# Altium project voltage.PrjPcb
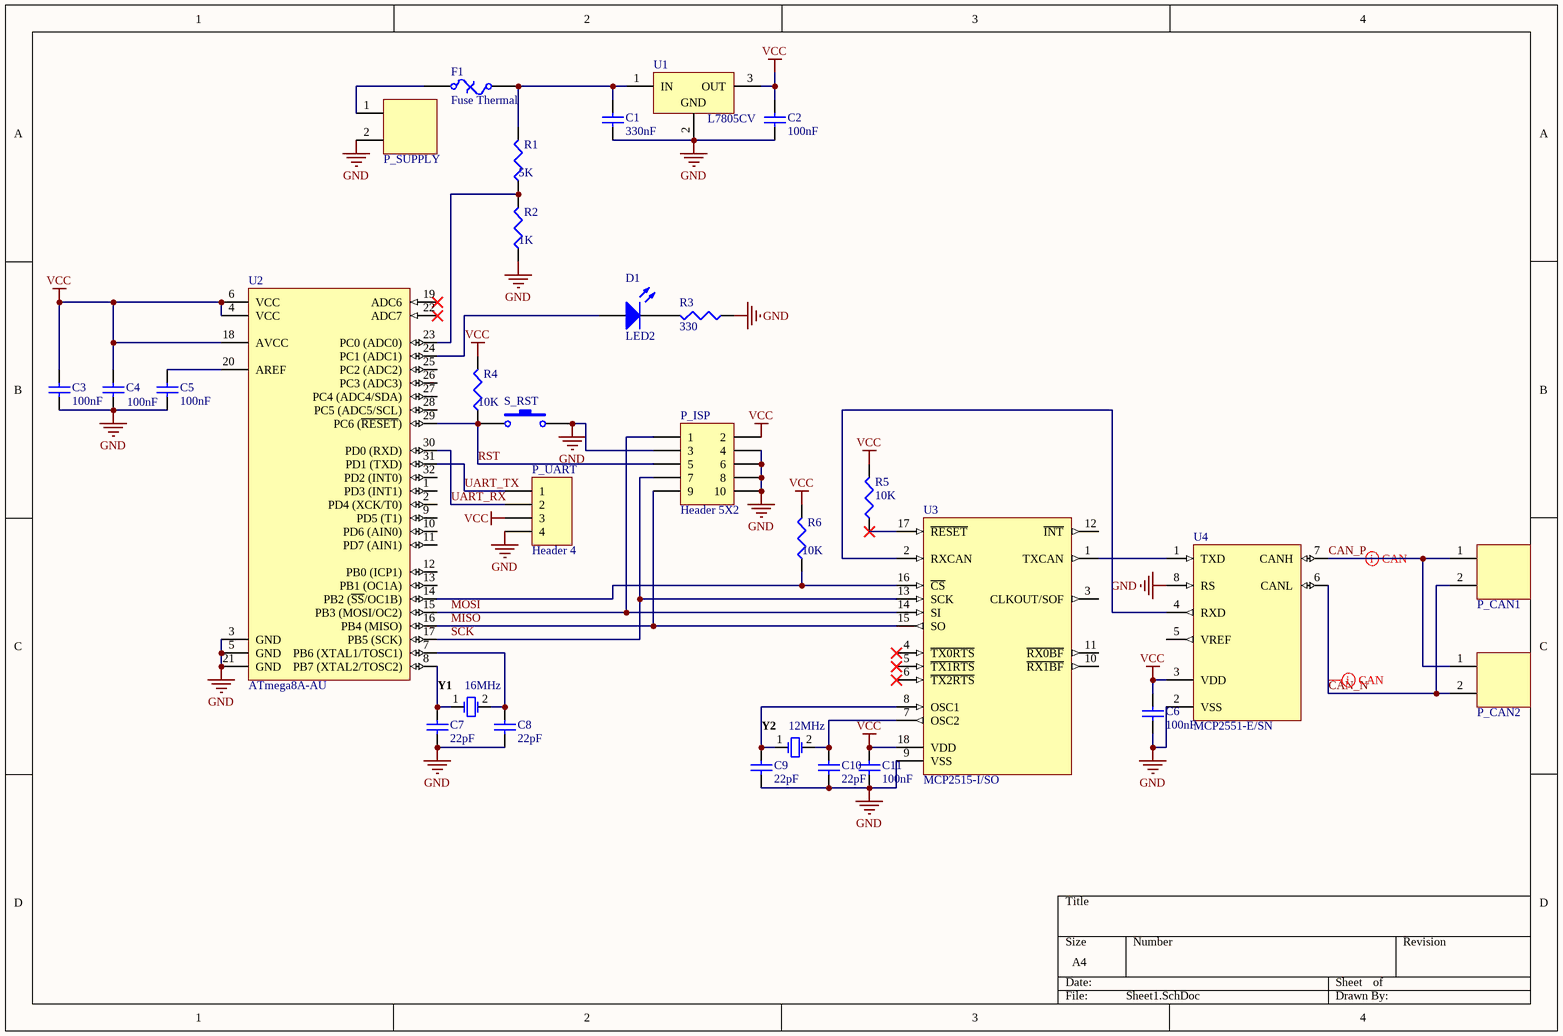
[diagram p0: Sheet1.SchDoc]
1 sheet, 31 parts. Net scope: global (net labels, ports and power ports of the same name join across sheets).
Board file: PCB1.PcbDoc

## Sheet Sheet1.SchDoc
size A4

### Parts
C1  value 330nF  [1608[0603]]  (hidden comment: Cap Semi)
C2  value 100nF  [1608[0603]]  (hidden comment: Cap Semi)
C3  value 100nF  [1608[0603]]  (hidden comment: Cap Semi)
C4  value 100nF  [1608[0603]]  (hidden comment: Cap Semi)
C5  value 100nF  [1608[0603]]  (hidden comment: Cap Semi)
C6  value 100nF  [1608[0603]]  (hidden comment: Cap Semi)
C7  value 22pF  [1608[0603]]  (hidden comment: Cap Semi)
C8  value 22pF  [1608[0603]]  (hidden comment: Cap Semi)
C9  value 22pF  [1608[0603]]  (hidden comment: Cap Semi)
C10  value 22pF  [1608[0603]]  (hidden comment: Cap Semi)
C11  value 100nF  [1608[0603]]  (hidden comment: Cap Semi)
D1  LED2  [3.2X1.6X1.1]
F1  Fuse Thermal  [PIN-W2/E2.8]
P_CAN1  Microfit 2  [mx2x1]  (value not drawn)
P_CAN2  Microfit 2  [mx2x1]  (value not drawn)
P_ISP  Header 5X2  [HDR2X5]
P_SUPPLY  BUCHANAN7744  [BUCHANAN7744]  (value not drawn)
P_UART  Header 4  [HDR1X4]
R1  value 5K  [J1-0603]  (hidden comment: Res3)
R2  value 1K  [J1-0603]  (hidden comment: Res3)
R3  value 330  [J1-0603]  (hidden comment: Res3)
R4  value 10K  [J1-0603]  (hidden comment: Res3)
R5  value 10K  [J1-0603]  (hidden comment: Res3)
R6  value 10K  [J1-0603]  (hidden comment: Res3)
S_RST  SW-PB  [SPST-2]  (value not drawn)
U1  L7805CV  [TO220]
U2  ATmega8A-AU  [32A_N]
U3  MCP2515-I/SO  [SOIC-SO18_L]
U4  MCP2551-E/SN  [SOIC-SN8_N]
Y1  value 16MHz  [FOX-FOXSLF-2_V]  (hidden comment: FOXSLF/120-20)
Y2  value 12MHz  [FOX-FOXSLF-2_V]  (hidden comment: FOXSLF/120-20)

### Nets
GND: C1.2 C2.2 C3.2 C4.2 C5.2 C6.2 C7.1 C8.1 C9.1 C10.1 C11.2 P_ISP.3 P_ISP.4 P_ISP.6 P_ISP.8 P_ISP.10 P_SUPPLY.2 P_UART.4 R2.1 R3.1 S_RST.2 U1.2(GND) U2.3(GND) U2.5(GND) U2.21(GND) U3.9(VSS) U4.2(VSS) U4.8(RS)
VCC: C2.1 C3.1 C4.1 C6.1 C11.1 P_ISP.2 P_UART.3 R4.2 R5.2 R6.2 U1.3(OUT) U2.4(VCC) U2.6(VCC) U2.18(AVCC) U3.18(VDD) U4.3(VDD)
CAN_N: P_CAN1.2 P_CAN2.2 U4.6(CANL)
CAN_P: P_CAN1.1 P_CAN2.1 U4.7(CANH)
MISO: P_ISP.9 U2.16(PB4_(MISO)) U3.15(SO)
MOSI: P_ISP.1 U2.15(PB3_(MOSI/OC2)) U3.14(SI)
RST: P_ISP.5 R4.1 S_RST.1 U2.29(PC6_(~{RESET}))
SCK: P_ISP.7 U2.17(PB5_(SCK)) U3.13(SCK)
UART_RX: P_UART.2 U2.30(PD0_(RXD))
UART_TX: P_UART.1 U2.31(PD1_(TXD))
NetC1_1: C1.1 F1.2 R1.2 U1.1(IN)
NetC5_1: C5.1 U2.20(AREF)
NetC7_2: C7.2 U2.8(PB7_(XTAL2/TOSC2)) Y1.1
NetC8_2: C8.2 U2.7(PB6_(XTAL1/TOSC1)) Y1.2
NetC9_2: C9.2 U3.8(OSC1) Y2.1
NetC10_2: C10.2 U3.7(OSC2) Y2.2
NetD1_1: D1.1(A) U2.24(PC1_(ADC1))
NetD1_2: D1.2(K) R3.2
NetF1_1: F1.1 P_SUPPLY.1
NetR1_1: R1.1 R2.2 U2.23(PC0_(ADC0))
NetR5_1: R5.1 U3.17(~{RESET})
NetR6_1: R6.1 U2.14(PB2_(~{SS}/OC1B)) U3.16(~{CS})
NetU3_1: U3.1(TXCAN) U4.1(TXD)
NetU3_2: U3.2(RXCAN) U4.4(RXD)

Not connected (* = marked no-connect by the designer): U2 1(PD3_(INT1)) 2(PD4_(XCK/T0)) 9(PD5_(T1)) 10(PD6_(AIN0)) 11(PD7_(AIN1)) 12(PB0_(ICP1)) 13(PB1_(OC1A)) 19(ADC6)* 22(ADC7)* 25(PC2_(ADC2)) 26(PC3_(ADC3)) 27(PC4_(ADC4/SDA)) 28(PC5_(ADC5/SCL)) 32(PD2_(INT0)); U3 3(CLKOUT/SOF) 4(~{TX0RTS})* 5(~{TX1RTS})* 6(~{TX2RTS})* 10(~{RX1BF}) 11(~{RX0BF}) 12(~{INT}); U4 5(VREF)

### Layout directives
differential pair: CAN_N, CAN_P

### Library data of the parts
C1-C11 = Cap Semi: Capacitor (Semiconductor SIM Model); Published: 8-Jun-2000; LatestRevisionDate: 29-May-2009; LatestRevisionNote: IPC-7351 Footprint Added.; PackageReference: C1206; Publisher: Altium Limited; PackageDescription: Chip Capacitor
D1 = LED2: Typical RED, GREEN, YELLOW, AMBER GaAs LED; Published: 8-Jun-2000; LatestRevisionDate: 17-Jul-2002; LatestRevisionNote: Re-released for DXP Platform.; PackageVersion: Feb-2002; PackageReference: 3.2X1.6X1.1; Publisher: Altium Limited; PackageDescription: SM LED; 2 Flat Leads
F1 = Fuse Thermal: Thermal Fuse; Published: 24-Mar-1999; LatestRevisionDate: 17-Jul-2002; LatestRevisionNote: Re-released for DXP Platform.; PackageReference: PIN-W2/E2.8; Publisher: Altium Limited; PackageDescription: Thru-Hole; 2 Leads
P_CAN1 P_CAN2 = MX2: Microfit 2x1
P_ISP = Header 5X2: Header, 5-Pin, Dual row; LatestRevisionDate: 17-Jul-2002; LatestRevisionNote: Re-released for DXP Platform.; Publisher: Altium Limited
P_UART = Header 4: Header, 4-Pin; LatestRevisionDate: 17-Jul-2002; LatestRevisionNote: Re-released for DXP Platform.; Publisher: Altium Limited
R1-R6 = Res3: Resistor; Published: 8-Jun-2000; LatestRevisionDate: 29-May-2009; LatestRevisionNote: IPC-7351 Footprint Added.; PackageReference: J1-0603; Publisher: Altium Limited; PackageDescription: Chip Resistor
S_RST = SW-PB: Switch; Published: 24-Mar-1999; LatestRevisionDate: 17-Jul-2002; LatestRevisionNote: Re-released for DXP Platform.; PackageReference: SPST-2; Publisher: Altium Limited; PackageDescription: Switch; 2 Leads
U1 = CMP-0244-00483-1: Positive Voltage Regulator, 5V, 3-Pin TO-220; PackageDescription: TO, Thru-Hole, Vertical, Heatsink Mounted; 3 In-Line Leads; Pitch 2.54 mm; ComponentLink2Description: Datasheet; PackageReference: TO220; ComponentLink3URL: http://www.st.com/internet/com/TECHNICAL_RESOURCES/TECHNICAL_LITERATURE/PACKAGE_INFORMATION/CD00004649.pdf; DatasheetVersion: 16/11/2011; ComponentLink1Description: Manufacturer URL; ComponentLink1URL: http://www.st.com; PackageVersion: ver3.0; ComponentLink3Description: Package Specification; ComponentLink2URL: http://www.st.com/internet/com/TECHNICAL_RESOURCES/TECHNICAL_LITERATURE/DATASHEET/CD00000444.pdf
U2 = CMP-0095-00219-2: 8-bit AVR Microcontroller, 2.7-5.5V, 16MHz, 8KB Flash, 512 Bytes EEPROM, 1KB SRAM, 32-pin TQFP, Industrial Grade (-40°C to 85°C); Code_JEDEC: MS-026-ABA; ComponentLink3URL: http://www.atmel.com/dyn/resources/prod_documents/8159S.pdf; PackageDescription: 32-Lead, 7x7x1.0 mm Body, 0.8mm Lead Pitch, Thin Profile Plastic Quad Flat Package (TQFP); DatasheetVersion: revD, Feb-2011; PackageVersion: revC, Oct-2010; ComponentLink2URL: http://www.atmel.com/dyn/resources/prod_documents/doc8159.pdf; RevisionNote: DatasheetVersion & PackageVersion updated. URLs added.; PackageReference: 32A; ComponentLink3Description: ATmega8A Summary; ComponentLink2Description: ATmega8A Datasheet; ComponentLink1Description: Manufacturer URL; ComponentLink1URL: http://www.atmel.com/
U3 = CMP-0186-00133-2: Stand-Alone CAN Controller With SPI Interface, 18-Pin SOIC, Industrial Temperature; ComponentLink2Description: Datasheet; RevisionNote: URLs added. DatasheetVersion updated.; PackageVersion: revBB, Aug-2009; ComponentLink1URL: http://www.microchip.com/; PackageReference: SOIC-SO18; PackageDescription: 18-Lead Plastic Small Outline (SO) - Wide 7.50mm Body [SOIC]; DatasheetVersion: revF, Oct-2010; ComponentLink2URL: http://ww1.microchip.com/downloads/en/DeviceDoc/21801f.pdf; ComponentLink3URL: http://www.microchip.com/stellent/groups/techpub_sg/documents/packagingspec/en012702.pdf; Code_JEDEC: MS-013; ComponentLink3Description: Package Specification; ComponentLink1Description: Manufacturer URL
U4 = CMP-0186-00038-2: High-Speed CAN Transceiver, 8-Pin SOIC, Extended Temperature; PackageReference: SOIC-SN8; Code_JEDEC: MS-012; ComponentLink1Description: Manufacturer URL; ComponentLink1URL: http://www.microchip.com/; PackageVersion: revBB, Aug-2009; ComponentLink3Description: Package Specification; Code_IPC: SOIC127P600-8; ComponentLink2URL: http://ww1.microchip.com/downloads/en/DeviceDoc/21667F.pdf; RevisionNote: URLs added. DatasheetVersion updated.; ComponentLink3URL: http://www.microchip.com/stellent/groups/techpub_sg/documents/packagingspec/en012702.pdf; DatasheetVersion: revF, Jul-2010; ComponentLink2Description: Datasheet; PackageDescription: 8-Lead Plastic Small Outline (SN) - Narrow, 3.90mm Body [SOIC]
Y1 Y2 = CMP-1749-00004-1: Resistance Weld Thru-Hole Crystal, 12 MHz, +/-30 ppm, -20 to 70 degC, 2-Pin THD, RoHS, Bulk; Elements: 1; Rds On Max: 115 mohm; Typical Rise Time: 90 ns; Max Power Dissipation: 2.5 W; Case\Package: TO-251-3; Input Capacitance: 350 pF; REACH SVHC: No SVHC; Length: 6.6 mm; ComponentLink1URL: http://www.foxonline.com/; PackageDescription: 2-Pin Through Hole Device, Body 11.35 x 4.65 mm, Pitch 4.88 mm; Radiation Hardening: No; Package Quantity: 70; Packaging: Rail/Tube; ComponentLink1Description: Manufacturer URL; Min Operating Temperature: -55 degC; Max Operating Temperature: 150 degC; RoHSCompliant: true; PackageReference: FOXSLF-2; DatasheetVersion: Mar-15; Pins: 3; Height: 6.1 mm; Mount: Through Hole; ComponentLink2URL: http://www.foxonline.com/pdfs/hc49slf.pdf; ComponentLink2Description: Datasheet; Width: 2.3 mm